# Altium schematic sheet MB_pwr_in.SchDoc: Приемопередатчик  SDR200
size 420 x 297 mm; Author: В.Титов; DrawnBy: В.Титов; DocumentNumber: ХХХХ.468179.001 Э3; SheetNumber: 1; SheetTotal: 7; DocumentType: Схема электрическая принципиальная; Title2: Материнская плата; Scale: 1:1
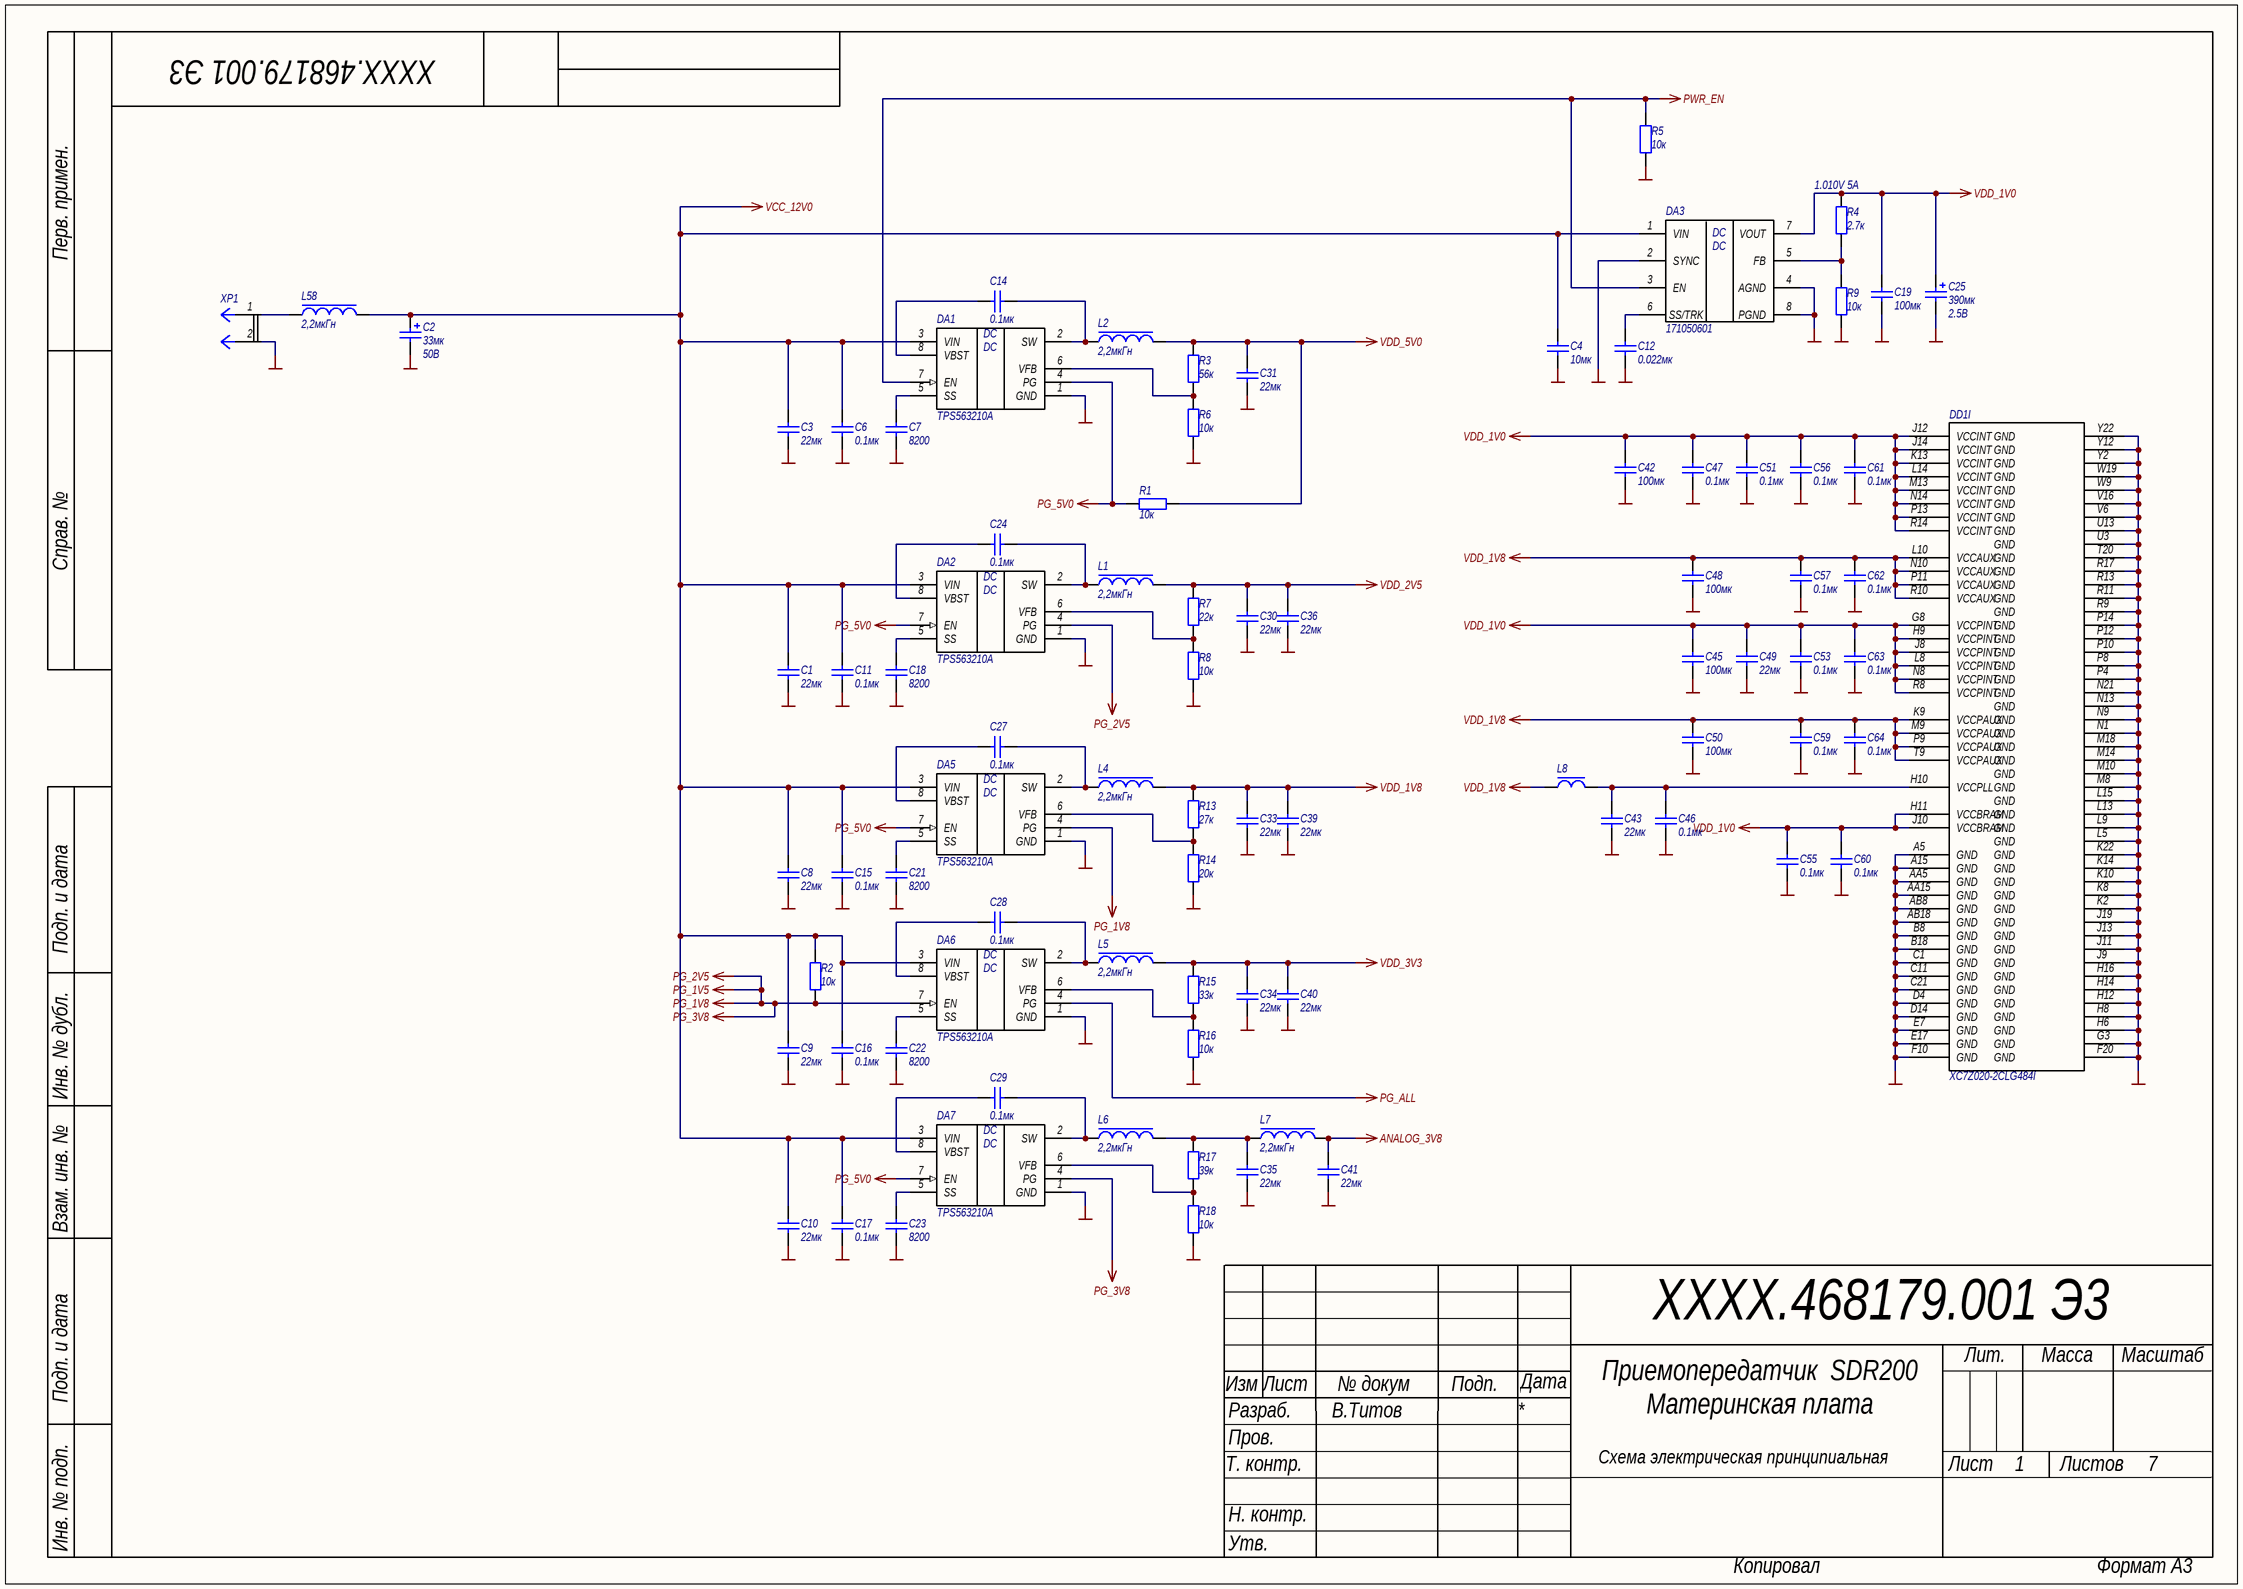
[diagram p0: MB_pwr_in.SchDoc]

## Parts
C1  22мк  [CAPC2012X12L]
C2  Power/Voltage: 50В  [CAPAE7664X77L]  (hidden comment: 33мк)
C3  22мк  [CAPC2012X12L]
C4  10мк  [CAPC3225X27L]
C6  0.1мк  [CAPC1005X06N]
C7  8200  [CAPC1005X06N]
C8  22мк  [CAPC2012X12L]
C9  22мк  [CAPC2012X12L]
C10  22мк  [CAPC2012X12L]
C11  0.1мк  [CAPC1005X06N]
C12  0.022мк  [CAPC1005X06N]
C14  0.1мк  [CAPC1005X06N]
C15  0.1мк  [CAPC1005X06N]
C16  0.1мк  [CAPC1005X06N]
C17  0.1мк  [CAPC1005X06N]
C18  8200  [CAPC1005X06N]
C19  100мк  [CAPC3216X19L]
C21  8200  [CAPC1005X06N]
C22  8200  [CAPC1005X06N]
C23  8200  [CAPC1005X06N]
C24  0.1мк  [CAPC1005X06N]
C25  Power/Voltage: 2.5В  [CAPAE7266X61N]  (hidden comment: 390мк)
C27  0.1мк  [CAPC1005X06N]
C28  0.1мк  [CAPC1005X06N]
C29  0.1мк  [CAPC1005X06N]
C30  22мк  [CAPC2012X12L]
C31  22мк  [CAPC2012X12L]
C33  22мк  [CAPC2012X12L]
C34  22мк  [CAPC2012X12L]
C35  22мк  [CAPC2012X12L]
C36  22мк  [CAPC2012X12L]
C39  22мк  [CAPC2012X12L]
C40  22мк  [CAPC2012X12L]
C41  22мк  [CAPC2012X12L]
C42  100мк  [CAPC3216X19L]
C43  22мк  [CAPC2012X12L]
C45  100мк  [CAPC3216X19L]
C46  0.1мк  [CAPC1005X06N]
C47  0.1мк  [CAPC1005X06N]
C48  100мк  [CAPC3216X19L]
C49  22мк  [CAPC2012X12L]
C50  100мк  [CAPC3216X19L]
C51  0.1мк  [CAPC1005X06N]
C53  0.1мк  [CAPC1005X06N]
C55  0.1мк  [CAPC1005X06N]
C56  0.1мк  [CAPC1005X06N]
C57  0.1мк  [CAPC1005X06N]
C59  0.1мк  [CAPC1005X06N]
C60  0.1мк  [CAPC1005X06N]
C61  0.1мк  [CAPC1005X06N]
C62  0.1мк  [CAPC1005X06N]
C63  0.1мк  [CAPC1005X06N]
C64  0.1мк  [CAPC1005X06N]
DA1  TPS563210A  [TSOP65P280X110-8N]
DA2  TPS563210A  [TSOP65P280X110-8N]
DA3  171050601  [TO263-7EP]
DA5  TPS563210A  [TSOP65P280X110-8N]
DA6  TPS563210A  [TSOP65P280X110-8N]
DA7  TPS563210A  [TSOP65P280X110-8N]
DD1  XC7Z020-2CLG484I  [BGA484C80P22X22_1900X1900X160]  (part I of 9)
L1  2,2мкГн  [CSAB0420]
L2  2,2мкГн  [CSAB0420]
L4  2,2мкГн  [CSAB0420]
L5  2,2мкГн  [CSAB0420]
L6  2,2мкГн  [CSAB0420]
L7  2,2мкГн  [CSAB0420]
L8  BLM18PG121SN1D  [INDC1608X08L]  (value not drawn)
L58  2,2мкГн  [CSAB0420]
R1  10к  [RESC1005X06N]
R2  10к  [RESC1005X06N]
R3  56к  [RESC1005X06N]
R4  2.7к  [RESC1005X06N]
R5  10к  [RESC1005X06N]
R6  10к  [RESC1005X06N]
R7  22к  [RESC1005X06N]
R8  10к  [RESC1005X06N]
R9  10к  [RESC1005X06N]
R13  27к  [RESC1005X06N]
R14  20к  [RESC1005X06N]
R15  33к  [RESC1005X06N]
R16  10к  [RESC1005X06N]
R17  39к  [RESC1005X06N]
R18  10к  [RESC1005X06N]
XP1  XT30UPB-M  [XT30UPB-M]  (value not drawn)

## Nets
ANALOG_3V8: C41.2 L7.2
GND: C1.1 C2.2 C3.1 C4.1 C6.1 C7.1 C8.1 C9.1 C10.1 C11.1 C12.1 C15.1 C16.1 C17.1 C18.1 C19.1 C21.1 C22.1 C23.1 C25.2 C30.1 C31.1 C33.1 C34.1 C35.1 C36.1 C39.1 C40.1 C41.1 C42.1 C43.1 C45.1 C46.1 C47.1 C48.1 C49.1 C50.1 C51.1 C53.1 C55.1 C56.1 C57.1 C59.1 C60.1 C61.1 C62.1 C63.1 C64.1 DA1.1(GND) DA2.1(GND) DA3.2(SYNC) DA3.4(AGND) DA3.8(PGND) DA5.1(GND) DA6.1(GND) DA7.1(GND) DD1.A5(GND) DD1.A15(GND) DD1.AA5(GND) DD1.AA15(GND) DD1.AB8(GND) DD1.AB18(GND) DD1.B8(GND) DD1.B18(GND) DD1.C1(GND) DD1.C11(GND) DD1.C21(GND) DD1.D4(GND) DD1.D14(GND) DD1.E7(GND) DD1.E17(GND) DD1.F10(GND) DD1.F20(GND) DD1.G3(GND) DD1.H6(GND) DD1.H8(GND) DD1.H12(GND) DD1.H14(GND) DD1.H16(GND) DD1.J9(GND) DD1.J11(GND) DD1.J13(GND) DD1.J19(GND) DD1.K2(GND) DD1.K8(GND) DD1.K10(GND) DD1.K14(GND) DD1.K22(GND) DD1.L5(GND) DD1.L9(GND) DD1.L13(GND) DD1.L15(GND) DD1.M8(GND) DD1.M10(GND) DD1.M14(GND) DD1.M18(GND) DD1.N1(GND) DD1.N9(GND) DD1.N13(GND) DD1.N21(GND) DD1.P4(GND) DD1.P8(GND) DD1.P10(GND) DD1.P12(GND) DD1.P14(GND) DD1.R9(GND) DD1.R11(GND) DD1.R13(GND) DD1.R17(GND) DD1.T20(GND) DD1.U3(GND) DD1.U13(GND) DD1.V6(GND) DD1.V16(GND) DD1.W9(GND) DD1.W19(GND) DD1.Y2(GND) DD1.Y12(GND) DD1.Y22(GND) R5.2 R6.2 R8.2 R9.2 R14.2 R16.2 R18.2 XP1.2
PG_1V5: DA2.4(PG) DA5.4(PG) DA6.7(EN) DA7.4(PG) R2.1  [also labelled PG_1V8, PG_2V5, PG_3V8]
PG_5V0: DA1.4(PG) DA2.7(EN) DA5.7(EN) DA7.7(EN) R1.2
PG_ALL: DA6.4(PG)
PWR_EN: DA1.7(EN) DA3.3(EN) R5.1
VCC_12V0: C1.2 C2.1 C3.2 C4.2 C6.2 C8.2 C9.2 C10.2 C11.2 C15.2 C16.2 C17.2 DA1.3(VIN) DA2.3(VIN) DA3.1(VIN) DA5.3(VIN) DA6.3(VIN) DA7.3(VIN) L58.2 R2.2
VDD_1V0: C19.2 C25.1 C42.2 C45.2 C47.2 C49.2 C51.2 C53.2 C55.2 C56.2 C60.2 C61.2 C63.2 DA3.7(VOUT) DD1.G8(VCCPINT) DD1.H9(VCCPINT) DD1.H11(VCCBRAM) DD1.J8(VCCPINT) DD1.J10(VCCBRAM) DD1.J12(VCCINT) DD1.J14(VCCINT) DD1.K13(VCCINT) DD1.L8(VCCPINT) DD1.L14(VCCINT) DD1.M13(VCCINT) DD1.N8(VCCPINT) DD1.N14(VCCINT) DD1.P13(VCCINT) DD1.R8(VCCPINT) DD1.R14(VCCINT) R4.2
VDD_1V8: C33.2 C39.2 C48.2 C50.2 C57.2 C59.2 C62.2 C64.2 DD1.K9(VCCPAUX) DD1.L10(VCCAUX) DD1.M9(VCCPAUX) DD1.N10(VCCAUX) DD1.P9(VCCPAUX) DD1.P11(VCCAUX) DD1.R10(VCCAUX) DD1.T9(VCCPAUX) L4.2 L8.1 R13.2
VDD_2V5: C30.2 C36.2 L1.2 R7.2
VDD_3V3: C34.2 C40.2 L5.2 R15.2
VDD_5V0: C31.2 L2.2 R1.1 R3.2
NetC7_2: C7.2 DA1.5(SS)
NetC12_2: C12.2 DA3.6(SS/TRK)
NetC14_1: C14.1 DA1.2(SW) L2.1
NetC14_2: C14.2 DA1.8(VBST)
NetC18_2: C18.2 DA2.5(SS)
NetC21_2: C21.2 DA5.5(SS)
NetC22_2: C22.2 DA6.5(SS)
NetC23_2: C23.2 DA7.5(SS)
NetC24_1: C24.1 DA2.2(SW) L1.1
NetC24_2: C24.2 DA2.8(VBST)
NetC27_1: C27.1 DA5.2(SW) L4.1
NetC27_2: C27.2 DA5.8(VBST)
NetC28_1: C28.1 DA6.2(SW) L5.1
NetC28_2: C28.2 DA6.8(VBST)
NetC29_1: C29.1 DA7.2(SW) L6.1
NetC29_2: C29.2 DA7.8(VBST)
NetC35_2: C35.2 L6.2 L7.1 R17.2
NetC43_2: C43.2 C46.2 DD1.H10(VCCPLL) L8.2
NetDA1_6: DA1.6(VFB) R3.1 R6.1
NetDA2_6: DA2.6(VFB) R7.1 R8.1
NetDA3_5: DA3.5(FB) R4.1 R9.1
NetDA5_6: DA5.6(VFB) R13.1 R14.1
NetDA6_6: DA6.6(VFB) R15.1 R16.1
NetDA7_6: DA7.6(VFB) R17.1 R18.1
NetL58_1: L58.1 XP1.1

## Notes on the sheet
- (near R4) 1.010V 5A
- Перв. примен.
- Справ. №
- Подп. и дата
- Инв. № дубл.
- Взам. инв. №
- Изм
- Лист
- № докум
- Подп.
- Дата
- Лит.
- Масса
- Масштаб
- Т. контр.
- Разраб.
- Пров.
- Листов
- Н. контр.
- Инв. № подп.
- Утв.
- Копировал
- Формат А3
- (in symbol Микросхема TPS563210A) DC
- (in symbol Микросхема WPMDM1500602JT / 171050601) DC

## Library data of the parts
C1 C3 C8-C10 C30 C31 C33-C36 C39-C41 C43 C49 = Кер.ЧИП конд. 0805 22мкФ X5R 10% 16В: Кер. ЧИП-конденсатор; Manufacturer: TDK; ManufacturerPartNumber: C2012X5R1C226KT; Power/Voltage: 16В; TKE: X5R; Tolerance: ±10%; Value: 22мк
C2 = Конденсатор гибридный SMD 33мкФ ±20% 50В: Гибридный ЧИП-конденсатор; ManufacturerPartNumber: EEHZC1H330XP; Manufacturer: Panasonic; Tolerance: ±20%; Published: 8-Jun-2000; LatestRevisionDate: 29-May-2009; LatestRevisionNote: IPC-7351 Footprint Added.; Publisher: Altium Limited; PackageDescription: ZC Series - Anti-Vibration; PackageReference: ZC Series; Value: 33мк
C4 = Кер.ЧИП конд. 1210 10мкФ X5R 20% 50В: Кер. ЧИП-конденсатор; Manufacturer: Murata; ManufacturerPartNumber: GRM32ER71H106; Power/Voltage: 50В; TKE: X5R; Tolerance: ±20%; Value: 10мк
C6 C11 C14-C17 C24 C27-C29 C46 C47 C51 C53 C55-C57 C59-C64 = Кер.ЧИП конд. 0402 0.1мкФ X7R 10%, 16В: Кер. ЧИП-конденсатор; Power/Voltage: 16В; TKE: X7R; Tolerance: ±10%; PackageReference: 0402; Value: 0.1мк
C7 C18 C21-C23 = Кер.ЧИП конд. 0402 8200пФ X7R 10%, 50В: Кер. ЧИП-конденсатор; Power/Voltage: 50В; TKE: X7R; Tolerance: ±20%; Value: 8200
C12 = Кер.ЧИП конд. 0402 0.022мкФ X7R 10%, 50В: Кер. ЧИП-конденсатор; Power/Voltage: 50В; TKE: X7R; Tolerance: ±20%; Value: 0.022мк
C19 C42 C45 C48 C50 = Кер.ЧИП конд. 1206 100мкФ X5R 20% 6.3В: Кер. ЧИП-конденсатор; Manufacturer: Murata; ManufacturerPartNumber: GRM31CR60J107ME39L; Power/Voltage: 6.3В; TKE: X5R; Tolerance: ±20%; Value: 100мк
C25 = Конденсатор гибридный SMD 390мкФ ±20% 2.5В: Aluminum Organic Polymer Capacitor; Manufacturer: Panasonic; ManufacturerPartNumber: EEHZC1H330XP; Tolerance: ±20%; Value: 390мк; Published: 8-Jun-2000; LatestRevisionDate: 29-May-2009; LatestRevisionNote: IPC-7351 Footprint Added.; Publisher: Altium Limited; PackageDescription: ZC Series - Anti-Vibration; PackageReference: ZC Series
DA1 DA2 DA5-DA7 = Микросхема TPS563210A: TPS56x210A, 4.5-V to 17-V Input, 2-A, 3-A Synchrono; Manufacturer: TI; Value: TPS563210A
DA3 = Микросхема WPMDM1500602JT / 171050601: MagI3C Power Module VDRM – Variable Step Down Regulator Module; Manufacturer: Würth Elektronik; Value: 171050601; ComponentLink1Description: datasheet; ComponentLink1URL: https://katalog.we-online.de/pm/datasheet/171050601.pdf
DD1 = Микросхема XC7Z020-2CLG484I: Zynq®-7000 SoC Family; Manufacturer: XILINX; Value: XC7Z020-2CLG484I; ComponentLink1Description: datasheet; ComponentLink1URL: https://www.xilinx.com/support/documentation/data_sheets/ds925-zynq-ultrascale-plus.pdf
L1 L2 L4-L7 L58 = ЧИП индуктивность CSAB0420-2R2M: Molding Power Choke; Manufacturer: Vishay; ManufacturerPartNumber: IHLP1616ABER1R0M11; Value: 2,2мкГн
L8 = ЧИП дроссель 0603 BLM18PG121SN1D: SMD EMI Suppression Filter EMIFIL; Manufacturer: Murata; ManufacturerPartNumber: BLM18PG121SN1D; Value: BLM18PG121SN1D
R1 R2 = Чип резистор 0402 10 кОм, 1%: ЧИП-резистор; Tolerance: ±5%; TKE: 100 ppm/°С; PackageReference: 0402; Value: 10к
R3 = Чип резистор 0402 56 кОм, 5%: ЧИП-резистор; Tolerance: ±5%; TKE: 100 ppm/°С; PackageReference: 0402; Value: 56к
R4 = Чип резистор 0402 2,7 кОм, 5%: ЧИП-резистор; Tolerance: ±5%; TKE: 100 ppm/°С; PackageReference: 0402; Value: 2.7к
R5 R6 R8 R9 R16 R18 = Чип резистор 0402 10 кОм, 5%: ЧИП-резистор; Tolerance: ±5%; TKE: 100 ppm/°С; PackageReference: 0402; Value: 10к
R7 = Чип резистор 0402 22 кОм, 5%: ЧИП-резистор; Tolerance: ±5%; TKE: 100 ppm/°С; PackageReference: 0402; Value: 22к
R13 = Чип резистор 0402 27 кОм, 5%: ЧИП-резистор; Tolerance: ±5%; TKE: 100 ppm/°С; PackageReference: 0402; Value: 27к
R14 = Чип резистор 0402 20 кОм, 5%: ЧИП-резистор; Tolerance: ±5%; TKE: 100 ppm/°С; PackageReference: 0402; Value: 20к
R15 = Чип резистор 0402 33 кОм, 5%: ЧИП-резистор; Tolerance: ±5%; TKE: 100 ppm/°С; PackageReference: 0402; Value: 33к
R17 = Чип резистор 0402 39 кОм, 5%: ЧИП-резистор; Tolerance: ±5%; TKE: 100 ppm/°С; PackageReference: 0402; Value: 39к
XP1 = Соединитель XT30UPB-M: AMASS XT30UPB-M  5 mm; Value: XT30UPB-M